# EasyEDA Pro project Temp_Con_V116.eprj, board TEMP_STM32
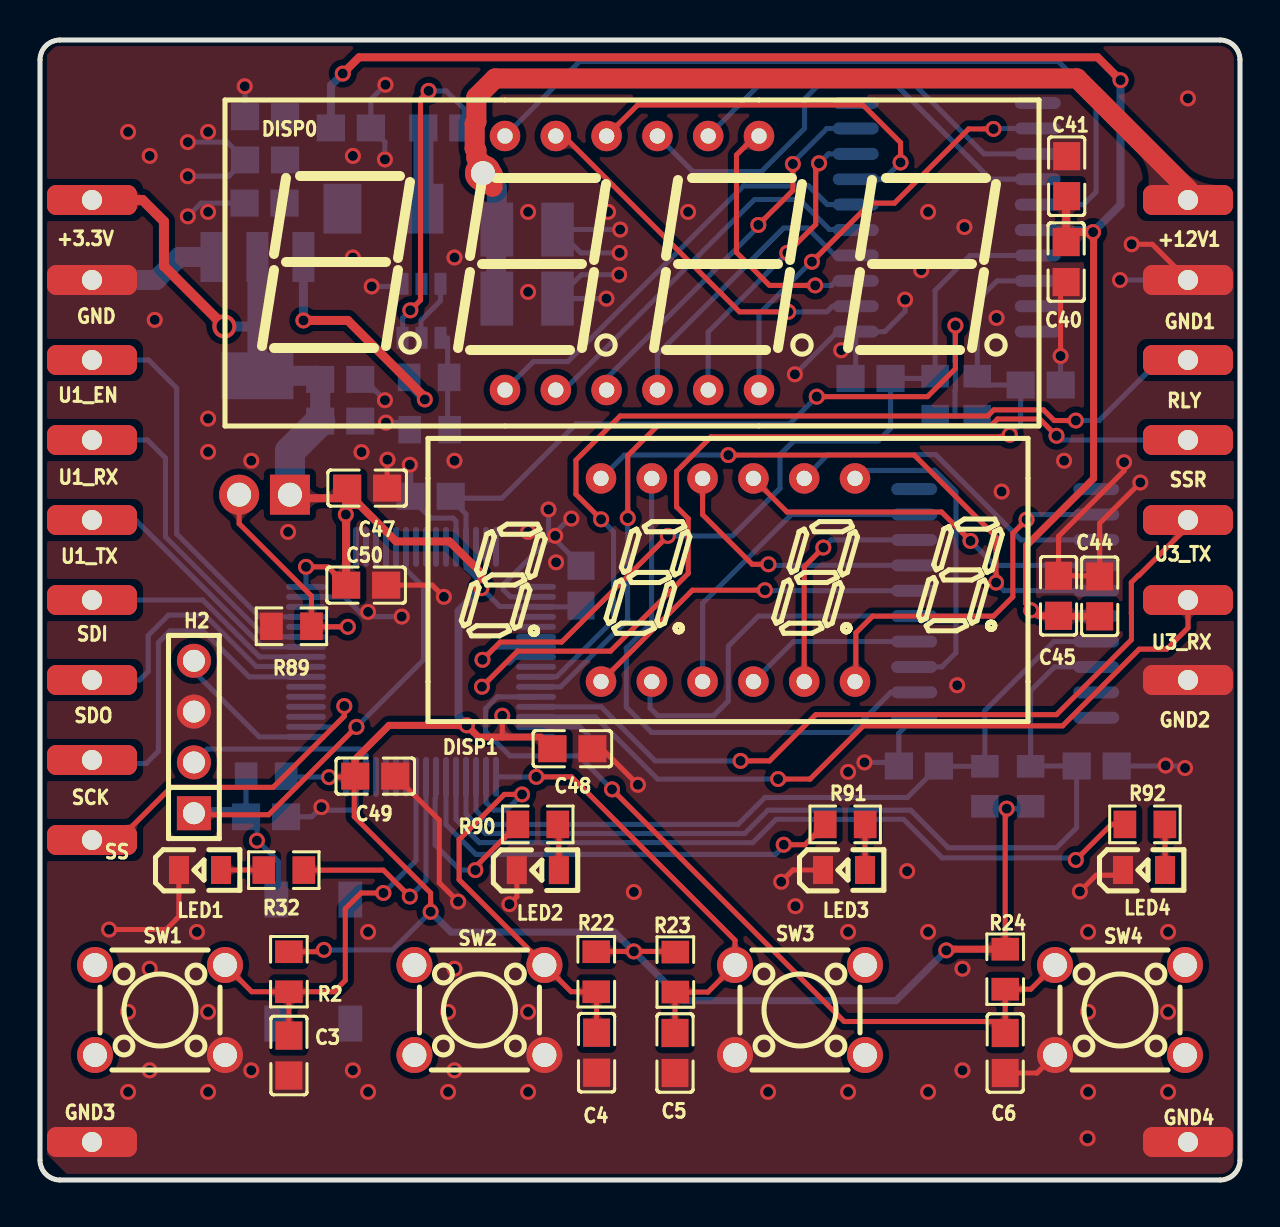
[diagram p6: board, top side]
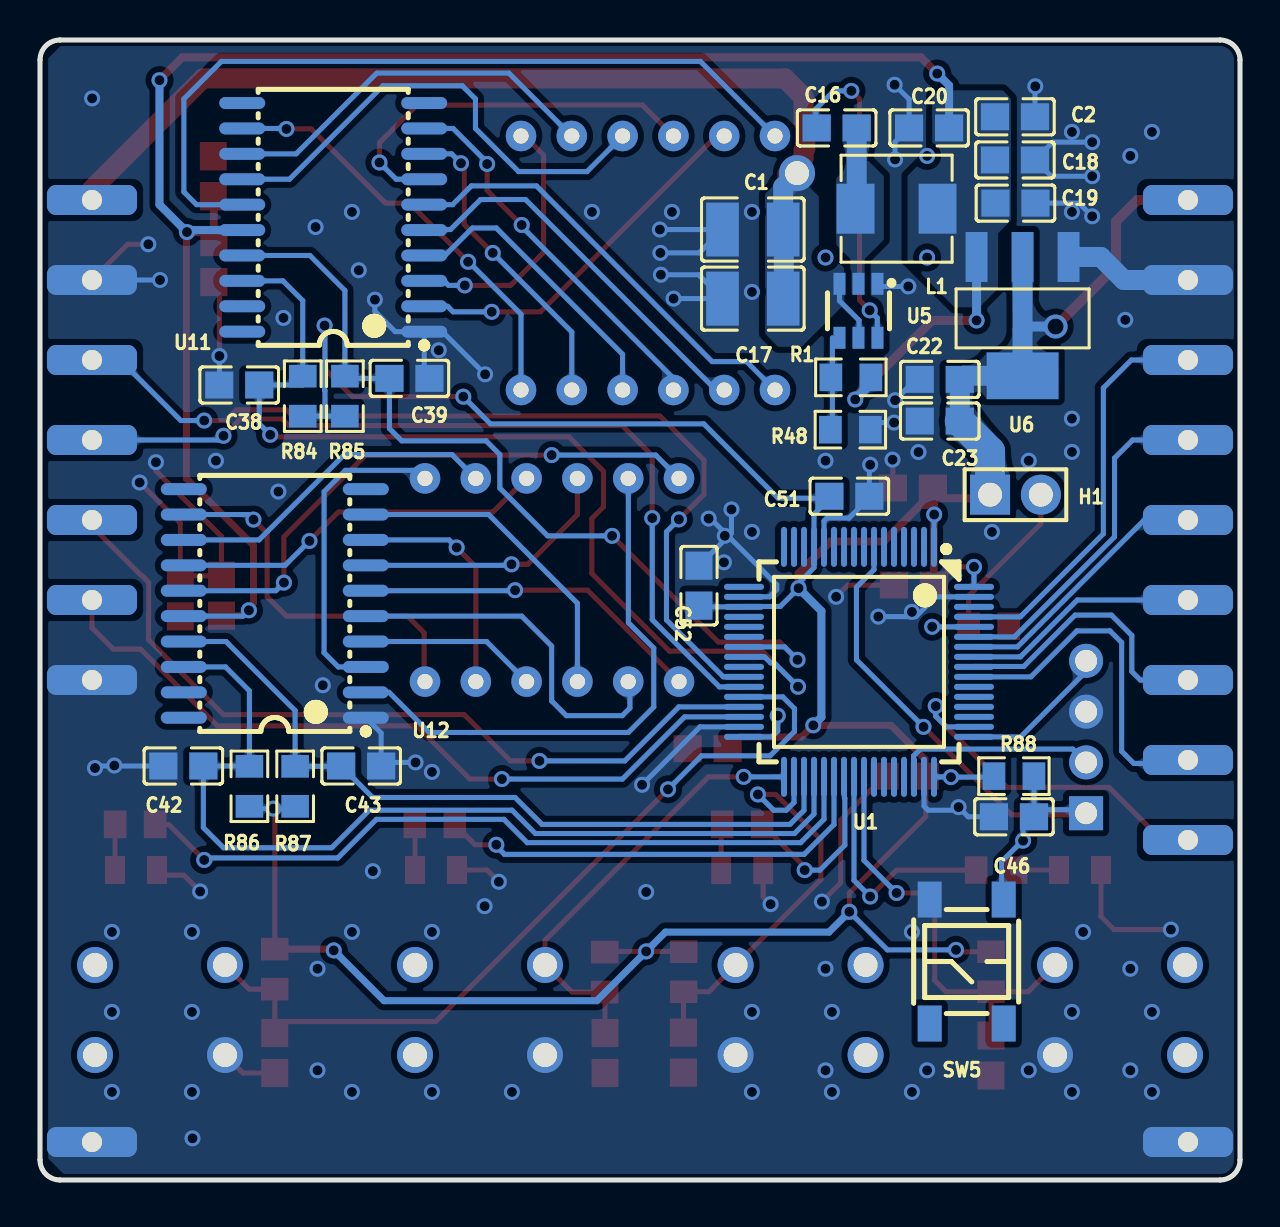
[diagram p7: board, bottom side, seen from below]

Outline 60 x 57 mm; copper layers: Top Layer, Bottom Layer. Coordinates in mm from the lower left corner of the outline.
Outline path: 0,56 0,1 arc(0.29,0.29) 1,0 59,0 arc(59.71,0.29) 60,1 60,56 arc(59.71,56.71) 59,57 1,57 arc(0.29,56.71) 0,56
Stack: Top Layer 0.035mm / Dielectric1 1.51mm FR4 er 4.5 / Bottom Layer 0.035mm

## Design rules (mm)
template: Custom Config
spacing copperThickness1oz (default): track to track 0.203, other pairs 0.201 to 0.305
spacing copperThickness2oz: track to track 0.203, other pairs 0.152 to 0.3
track width copperThickness1oz (default): min 0.127, default 0.254, max 2.54
track width copperThickness2oz: min 0.203, default 0.254, max 2.54
differential pair differentialPair (default): width min 0.127, default 0.254, max 2.54; gap min 0.152, default 0.152
via viaSize (default): diameter min 0.5, default 0.8, max 10; hole min 0.5, default 0.5, max 10

## Placement (name value [footprint] x y rotation side)
+3.3V  -  [S_FT]  2.6 49 90 top
+12V1  -  [S_FT]  57.4 49 90 top
C1  10uF  [C1210]  24.36 47.52 180 bottom
C2  22uF  [C0805]  11.25 53.16 0 bottom
C3  100nF  [C0805]  12.45 6.22 90 top
C4  100nF  [C0805]  27.83 6.37 90 top
C5  100nF  [C0805]  31.75 6.35 90 top
C6  100nF  [C0805]  48.26 6.35 90 top
C16  100nF  [C0805]  20.17 52.6 180 bottom
C17  10uF  [C1210]  24.36 44.07 180 bottom
C18  22uF  [C0805]  11.25 51 0 bottom
C19  22uF  [C0805]  11.23 48.84 0 bottom
C20  100nF  [C0805]  15.54 52.6 180 bottom
C22  100nF  [C0805]  15.01 40.03 180 bottom
C23  10uF  [C0805]  15.01 37.95 180 bottom
C38  100pF  [C0805]  50.04 39.75 180 bottom
C39  100pF  [C0805]  41.53 40.08 0 bottom
C40  22uF  [C0805]  51.31 45.9 90 top
C41  100nF  [C0805]  51.33 50.19 270 top
C42  100pF  [C0805]  52.83 20.7 180 bottom
C43  100pF  [C0805]  43.94 20.7 0 bottom
C44  22uF  [C0805]  52.98 29.18 270 top
C45  100nF  [C0805]  50.93 29.21 270 top
C46  100nF  [C0805]  11.3 18.16 180 bottom
C47  100pF  [C0805]  16.36 34.59 180 top
C48  100pF  [C0805]  26.62 21.56 180 top
C49  100pF  [C0805]  16.76 20.19 180 top
C50  100pF  [C0805]  16.31 29.74 180 top
C51  100pF  [C0805]  19.53 34.19 0 bottom
C52  100pF  [C0805]  27.05 29.72 270 bottom
DISP0  FJ4401BH  [LED-SEG-TH_12P-L40.4-W16.0-P2.54-S12.70-BL]  29.6 45.85 0 top
DISP1  FJ3461BH  [LED-SEG-TH_12P-L30.0-W13.7-P2.54-S10.16-BL]  34.4 30 0 top
GND  -  [S_FT]  2.6 45 270 top
GND1  -  [S_FT]  57.4 45 90 top
GND2  -  [S_FT]  57.4 25 90 top
GND3  -  [S_FT]  2.6 1.9 270 top
GND4  -  [S_FT]  57.4 1.9 90 top
H1  PZ254V-11-02P  [HDR-TH_2P-P2.54-V-M]  11.23 34.26 180 bottom
H2  PZ254V-11-04P  [HDR-TH_4P-P2.54-V-M]  7.7 22.15 90 top
L1  3.3uH  [IND-SMD_L5.4-W5.2_RS0530]  17.17 48.56 0 bottom
LED1  XL-2012SURC  [LED0805-R-RD]  8 15.5 0 top
LED2  XL-2012SURC  [LED0805-R-RD]  24.89 15.49 0 top
LED3  XL-2012SURC  [LED0805-R-RD]  40.2 15.5 0 top
LED4  XL-2012SURC  [LED0805-R-RD]  55.2 15.5 0 top
NOREF  -  [Pad_e2339]  22.15 50.34 0 top
R1  56.2kΩ  [R0805]  19.46 40.13 0 bottom
R2  10kΩ  [R0805]  12.45 10.41 90 top
R22  10kΩ  [R0805]  27.81 10.41 90 top
R23  10kΩ  [R0805]  31.77 10.4 90 top
R24  10kΩ  [R0805]  48.26 10.54 90 top
R32  1kΩ  [R0805]  12.19 15.49 0 top
R48  10kΩ  [R0805]  19.48 37.52 0 bottom
R84  10kΩ  [R0805]  46.86 39.19 270 bottom
R85  10kΩ  [R0805]  44.75 39.19 270 bottom
R86  10kΩ  [R0805]  49.53 19.69 270 bottom
R87  10kΩ  [R0805]  47.24 19.69 270 bottom
R88  10kΩ  [R0805]  11.3 20.19 0 bottom
R89  10kΩ  [R0805]  12.57 27.69 0 top
R90  1kΩ  [R0805]  24.89 17.78 180 top
R91  1kΩ  [R0805]  40.26 17.78 180 top
R92  1kΩ  [R0805]  55.25 17.78 180 top
RLY  -  [S_FT]  57.4 41 90 top
SCK  -  [S_FT]  2.6 21 270 top
SDI  -  [S_FT]  2.6 29 90 top
SDO  -  [S_FT]  2.6 25 90 top
SS  -  [S_FT]  2.6 17 90 top
SSR  -  [S_FT]  57.4 37 90 top
SW1  YTS1R0011FBT00  [SW-TH_4P-L6.0-W6.0-P4.50-LS6.5]  6 8.5 0 top
SW2  YTS1R0011FBT00  [SW-TH_4P-L6.0-W6.0-P4.50-LS6.5]  21.97 8.5 0 top
SW3  YTS1R0011FBT00  [SW-TH_4P-L6.0-W6.0-P4.50-LS6.5]  38 8.5 0 top
SW4  YTS1R0011FBT00  [SW-TH_4P-L6.0-W6.0-P4.50-LS6.5]  54 8.5 0 top
SW5  TSC005A1618A03  [KEY-SMD_4P-L5.2-W5.2-P3.70-LS6.4]  13.67 10.92 270 bottom
U1  STM32F103RCT6  [LQFP-64_L10.0-W10.0-P0.50-LS12.0-BL]  19.05 25.91 0 bottom
U1_EN  -  [S_FT]  2.6 41 90 top
U1_RX  -  [S_FT]  2.6 37 90 top
U1_TX  -  [S_FT]  2.6 33 90 top
U3_RX  -  [S_FT]  57.4 29 90 top
U3_TX  -  [S_FT]  57.4 33 90 top
U5  TPS562208DDCR  [SOT-23-6_L2.9-W1.6-P0.95-LS2.8-BR]  19.08 43.46 90 bottom
U6  AMS1117-3.3  [SOT-223-3_L6.5-W3.4-P2.30-LS7.0-BR]  10.87 43.18 90 bottom
U11  TM1637  [SOP-20_L12.8-W7.5-P1.27-LS10.4-BL]  45.34 48.13 90 bottom
U12  TM1637  [SOP-20_L12.8-W7.5-P1.27-LS10.4-BL]  48.26 28.83 90 bottom

## Footprints (pads in the part's own frame, mm; a bottom-side part is the same pattern mirrored in y, then rotated)
C0805
  rect 1.41x1.35 smd: 1(-1,0) 2(1,0)
C1210
  rect 1.635x2.7 smd: 1(-1.518,0) 2(1.518,0)
HDR-TH_2P-P2.54-V-M
  rect 2x2 hole 1.2: 1(-1.27,0)
  round 2 hole 1.2: 2(1.27,0)
HDR-TH_4P-P2.54-V-M
  rect 1.7x1.7 hole 1.1: 1(-3.81,0)
  round 1.7 hole 1.1: 2(-1.27,0) 3(1.27,0) 4(3.81,0)
IND-SMD_L5.4-W5.2_RS0530
  rect 1.9x2.5 smd: 1(2.05,0) 2(-2.05,0)
KEY-SMD_4P-L5.2-W5.2-P3.70-LS6.4
  rect 1.8x1.2 smd: 1(-3.1,1.85) 2(3.1,1.85) 3(-3.1,-1.85) 4(3.1,-1.85)
LED0805-R-RD
  rect 1x1.399 smd: 1(1.05,0) 2(-1.05,0)
LED-SEG-TH_12P-L30.0-W13.7-P2.54-S10.16-BL
  round 1.524 hole 0.762: 1(-6.35,-5.08) 2(-3.81,-5.08) 3(-1.27,-5.08) 4(1.27,-5.08) 5(3.81,-5.08) 6(6.35,-5.08) 7(6.35,5.08) 8(3.81,5.08) 9(1.27,5.08) 10(-1.27,5.08) 11(-3.81,5.08) 12(-6.35,5.08)
LED-SEG-TH_12P-L40.4-W16.0-P2.54-S12.70-BL
  round 1.524 hole 0.762: 1(-6.35,-6.35) 2(-3.81,-6.35) 3(-1.27,-6.35) 4(1.27,-6.35) 5(3.81,-6.35) 6(6.35,-6.35) 7(6.35,6.35) 8(3.81,6.35) 9(1.27,6.35) 10(-1.27,6.35) 11(-3.81,6.35) 12(-6.35,6.35)
LQFP-64_L10.0-W10.0-P0.50-LS12.0-BL
  oval 0.3x2 smd: 1(-3.75,-5.75) 2(-3.25,-5.75) 3(-2.75,-5.75) 4(-2.25,-5.75) 5(-1.75,-5.75) 6(-1.25,-5.75) 7(-0.75,-5.75) 8(-0.25,-5.75) 9(0.25,-5.75) 10(0.75,-5.75) 11(1.25,-5.75) 12(1.75,-5.75) 13(2.25,-5.75) 14(2.75,-5.75) 15(3.25,-5.75) 16(3.75,-5.75) 33(3.75,5.75) 34(3.25,5.75) 35(2.75,5.75) 36(2.25,5.75) 37(1.75,5.75) 38(1.25,5.75) 39(0.75,5.75) 40(0.25,5.75) 41(-0.25,5.75) 42(-0.75,5.75) 43(-1.25,5.75) 44(-1.75,5.75) 45(-2.25,5.75) 46(-2.75,5.75) 47(-3.25,5.75) 48(-3.75,5.75)
  oval 2x0.3 smd: 17(5.75,-3.75) 18(5.75,-3.25) 19(5.75,-2.75) 20(5.75,-2.25) 21(5.75,-1.75) 22(5.75,-1.25) 23(5.75,-0.75) 24(5.75,-0.25) 25(5.75,0.25) 26(5.75,0.75) 27(5.75,1.25) 28(5.75,1.75) 29(5.75,2.25) 30(5.75,2.75) 31(5.75,3.25) 32(5.75,3.75) 49(-5.75,3.75) 50(-5.75,3.25) 51(-5.75,2.75) 52(-5.75,2.25) 53(-5.75,1.75) 54(-5.75,1.25) 55(-5.75,0.75) 56(-5.75,0.25) 57(-5.75,-0.25) 58(-5.75,-0.75) 59(-5.75,-1.25) 60(-5.75,-1.75) 61(-5.75,-2.25) 62(-5.75,-2.75) 63(-5.75,-3.25) 64(-5.75,-3.75)
Pad_e2339
  round 1.8 hole 1.2: 1(0,0)
R0805
  rect 1.133x1.377 smd: 1(-1,0) 2(1,0)
S_FT
  rrect 1.5x4.5 hole 1: 1(0,0)
SOP-20_L12.8-W7.5-P1.27-LS10.4-BL
  oval 0.6x2.3 smd: 1(-5.715,-4.55) 2(-4.445,-4.55) 3(-3.175,-4.55) 4(-1.905,-4.55) 5(-0.635,-4.55) 6(0.635,-4.55) 7(1.905,-4.55) 8(3.175,-4.55) 9(4.445,-4.55) 10(5.715,-4.55) 11(5.715,4.55) 12(4.445,4.55) 13(3.175,4.55) 14(1.905,4.55) 15(0.635,4.55) 16(-0.635,4.55) 17(-1.905,4.55) 18(-3.175,4.55) 19(-4.445,4.55) 20(-5.715,4.55)
SOT-23-6_L2.9-W1.6-P0.95-LS2.8-BR
  rect 1.1x0.6 smd: 1(1.35,-0.95) 2(1.35,0) 3(1.35,0.95) 4(-1.35,0.95) 5(-1.35,0) 6(-1.35,-0.95)
SOT-223-3_L6.5-W3.4-P2.30-LS7.0-BR
  rect 2.5x1.1 smd: 1(2.97,-2.3) 2(2.97,0) 3(2.97,2.3)
  rect 2.34x3.6 smd: 4(-2.97,0)
SW-TH_4P-L6.0-W6.0-P4.50-LS6.5
  round 1.8 hole 1.2: 1(-3.25,2.25) 2(3.25,2.25) 3(-3.25,-2.25) 4(3.25,-2.25)

## Nets
As in the schematic, except:
+12V: +12V1.1 C1.2 C17.2 NOREF.1 U5.3 U5.5

Pads without a net: SW1 1 3; SW2 1 3; SW3 2 4; SW4 2 4; SW5 2 4; U1 2 3 4 5 6 8 9 10 11 14 15 16 17 20 21 22 25 42 43 44 45 51 52 53 54 62; U11 10 11 19 20; U12 10 11 19 20

## Via types
v1: diameter 0.8, hole 0.5, Top Layer to Bottom Layer, 161 vias
v2: diameter 1.2, hole 0.8, Top Layer to Bottom Layer, 1 via

## Routing (per net, layer and track width the routed paths; a pad name or vN(x,y) marks a point on that pad's centre or on a via; arc(x,y) is an arc through that point)
+3.3V: length 184.9
  Top Layer w0.254: R22.2 27.83,11.43 v1(29.69,11.43) 31.73,11.43 R23.2 ; v1(48.34,18.57) 48.26,18.49 R24.2 ; 15.71,20.14 C49.2 ; 15.71,20.14 v1(14.45,20.14) ; 15.71,20.14 15.71,18.17 19.53,14.35 v1(19.53,13.41) ; v1(38.84,39.17) 44.37,39.17 45.77,40.56 v1(45.77,42.72) ; v1(14.2,11.51) 14.11,11.41 R2.2 ; 25.03,22.15 C48.2 ; C50.2 14.39,30.66 v1(13.3,30.66) ; v1(23.11,23.22) 23.11,22.15
  Top Layer w0.35: 25.03,22.15 21.92,22.15 v1(21.34,22.73) 17.45,22.73 15.75,21.03 15.75,20.21 C49.2 ; R24.2 45.37,11.54 v1(45.31,11.48)
  Top Layer w0.4: C50.2 15.31,33.26 v1(15.29,33.27) 15.31,33.29 15.31,33.75 ; 15.31,33.75 15.31,34.09 12.67,34.09 H1.1 ; 15.31,33.75 15.82,33.75 15.85,33.78 15.95,33.78 17.81,31.93 20.47,31.93 22.07,30.33 v1(22.07,29.59)
  Top Layer w0.5: +3.3V.1 5.13,49 6.2,47.93 6.2,45.7 v2(9.22,42.67)
  Bottom Layer w0.254: U1.64 v1(13.3,30.66) ; U1.32 23.41,22.16 23.11,22.45 v1(23.11,23.22) ; U1.1 15.3,33.27 v1(15.29,33.27) ; v1(19.53,13.41) 17.63,11.51 v1(14.2,11.51) ; v1(45.77,42.72) 45.75,42.7 45.75,40.92 45.77,40.89 45.77,39.49 45.75,39.46 45.75,38.19 ; R87.2 47.36,18.57 v1(48.34,18.57) 49.41,18.57 R86.2 ; R88.2 12.35,20.14 v1(14.45,20.14) 14.47,20.16 U1.48 ; 45.75,38.19 R84.2 ; 45.75,38.19 R85.2 ; C52.2 26.99,28.66 U1.19 24.78,28.68 22.99,28.68 v1(22.07,29.59) 22.07,29.84 21.3,30.62 U1.13 21.3,33.29 20.53,34.06 20.55,34.09 23.09,34.09 26.81,37.81 37.48,37.81 v1(38.84,39.17)
  Bottom Layer w0.35: v1(45.31,11.48) 42.8,8.97 32.16,8.97 v1(29.69,11.43) 28.73,12.39 20.55,12.39 v1(19.53,13.41)
  Bottom Layer w0.4: v1(21.34,22.73) 20.93,23.14 20.93,28.45 v1(22.07,29.59)
  Bottom Layer w0.5: 10.87,42.51 10.7,42.67 v2(9.22,42.67)
  Bottom Layer w1: C23.2 C22.2 13.83,40.21 U6.4 U6.2
  Bottom Layer w1.5: H1.1 12.5,36.43 C23.2
+5V: length 96.9
  Top Layer w0.254: v1(49.56,28.49) 49.56,28.63
  Top Layer w0.35: C44.2 50.95,28.18 C45.2 49.97,28.21 49.56,28.63 49.33,28.85 49.33,31.72 52.68,35.08 52.68,47.09
  Top Layer w0.4: v1(52.65,47.4) 51.81,47.4 C40.2 51.31,49.13 arc(51.31,49.16) C41.2 ; v1(15.14,55.32) 15.95,56.13 52.88,56.13 v1(54.03,54.99)
  Top Layer w0.45: v1(19.24,39.03) 19.24,39.13 15.39,42.98 v1(13.17,42.98)
  Bottom Layer w0.254: U12.16 49.85,28.19 v1(49.56,28.49)
  Bottom Layer w0.4: v1(54.03,54.99) 54.03,48.77 v1(52.65,47.4) 52.55,47.5 U11.16 ; C20.2 14.54,54.73 v1(15.14,55.32)
  Bottom Layer w0.45: v1(19.24,39.03) 18.46,39.81 R1.1 ; U6.3 v1(13.17,42.98)
+12V: length 53.7
  Top Layer w1: +12V1.1 57.4,49.53 51.85,55.08 22.75,55.08 21.82,54.14 21.82,52.91 21.73,52.83 21.73,51.57 21.82,51.49 21.82,51.11 22.63,50.29 22.63,49.66
  Bottom Layer w0.254: 19.05,41.76 19.05,42.99 20.03,43.96 U5.3
  Bottom Layer w1: NOREF.1 22.84,49.65 C1.2 ; 22.81,47.52 22.81,44.1 C17.2
GND: length 147.8
  Top Layer w0.254: C47.1 17.36,36 v1(17.37,36.02) ; C6.1 49.85,5.35 SW4.3 ; GND1.1 55.61,46.79 v1(54.58,46.79) ; v1(23.47,13.79) 23.84,14.16 LED2.2 ; v1(20.9,13.92) 19.96,14.86 19.96,17.99 C49.1 ; v1(20.19,29.16) 19.61,29.74 C50.1 ; LED4.2 53.89,15.24 52.81,15.24 v1(51.99,14.43) ; v1(29.9,19.76) 28.09,21.56 C48.1 ; LED1.2 6.95,13.17 6.3,12.52 v1(3.45,12.52) ; v1(54.2,35.89) 54.2,35.46 50.93,32.18 C45.1 52.96,30.21 C44.1 52.98,32.84 v1(55.02,34.87) ; 51.05,45.36 51.03,45.33 v1(51.03,41.2) ; LED3.2 37.65,15.5 v1(37.06,14.91)
  Bottom Layer w0.254: v1(10.24,54.69) 10.25,54.67 C2.1 ; C39.1 40.79,40.34 U11.1 ; v1(25.43,33.53) 25.43,32.34 25.58,32.19 ; v1(29.9,19.76) 27,22.66 U1.31 ; C52.1 25.58,32.19 ; 25.58,32.19 26.47,33.07 v1(26.57,33.07) ; 25.58,32.19 23.16,29.77 23.16,29.52 23.52,29.16 24.8,29.16 ; U1.63 15.22,29.16 16.21,28.17 v1(18.09,28.17) ; v1(16.59,44.68) 17.99,44.68 U5.1 ; C51.1 18.53,35.72 v1(18.49,35.76) ; v1(17.27,54.76) 16.54,54.03 C20.1 17.25,51.9 v1(17.25,51.03) ; U1.47 15.8,18.7 15.6,18.49 14.22,18.49 v1(14.07,18.64) 13.59,18.16 C46.1 ; 18.58,34.06 19.55,33.1 20.65,33.1 20.8,32.95 U1.12 ; v1(51.03,41.2) 51.03,39.76 C38.1 ; v1(17.3,37.87) 18.13,37.87 R48.1 ; C22.1 16.21,40.03 v1(17.25,38.99) ; v1(41.22,20.88) 42.76,20.88 C43.1 42.94,22.35 U12.1 ; v1(28.96,45.26) 27.07,45.26 C17.1 v1(28.32,44.07) ; v1(7.39,50.19) 9.44,50.19 C18.1 9.36,51.89 v1(7.39,51.89) ; 18.53,34.06 18.53,34.06 ; U11.1 39.88,42.42 v1(37.74,40.28) ; U11.1 42.24,42.42 43.26,43.43 v1(43.26,44.02) ; C19.1 8.05,48.84 v1(7.39,48.18) ; GND1.1 v1(54,45) ; v1(29.01,47.52) C1.1 27.04,46.36 v1(28.98,46.36) ; v1(57.25,20.6) 57.15,20.7 C42.1
  Bottom Layer w1: U6.1 6.96,46.15 5.81,45 GND.1
  vias: v1(4.4,52.4) v1(4.4,8.4) v1(4.4,4.4) v1(5.48,51.2) v1(5.48,10.56) v1(5.48,5.48) v1(5.74,43.01) v1(7.85,12.4) v1(8.4,52.4) v1(8.4,48.4) v1(8.4,38.07) v1(8.4,36.4) v1(8.4,8.4) v1(8.4,4.4) v1(10.56,35.96) v1(10.56,5.48) v1(12.4,32.4) v1(15.64,51.2) v1(15.64,46.12) v1(15.64,5.48) v1(16.08,36.4) v1(16.4,28.4) v1(16.4,12.4) v1(16.4,4.4) v1(20.4,8.4) v1(20.4,4.4) v1(20.72,46.12) v1(20.72,35.96) v1(20.72,10.56) v1(20.72,5.48) v1(24.4,48.4) v1(24.4,44.4) v1(24.4,32.4) v1(24.4,8.4) v1(24.4,4.4) v1(25.76,32.21) v1(25.8,30.88) v1(28.4,48.4) v1(29.69,14.4) v1(32.4,48.4) v1(36.4,4.4) v1(37.77,13.69) v1(40.06,41.49) v1(40.4,20.4) v1(40.4,12.4) v1(40.4,4.4) v1(43.36,15.44) v1(44.06,45.49) v1(44.4,48.4) v1(44.4,12.4) v1(44.4,4.4) v1(45.86,24.74) v1(46.12,10.56) v1(46.12,5.48) v1(46.22,47.65) v1(47.83,43.1) v1(48.08,34.42) v1(51.2,35.96) v1(52.4,12.4) v1(52.4,8.4) v1(52.4,4.4) v1(52.38,2.08) v1(56.28,20.72) v1(56.4,12.4) v1(56.4,8.4) v1(56.4,4.4) v1(57.39,54.08)
BOOT0: length 12
  Top Layer w0.254: v1(15.39,27.66) 13.6,27.66 R89.2 13.57,29.2 9.96,32.82 H1.2
  Bottom Layer w0.254: v1(15.39,27.66) 15.39,27.66 U1.60
CLK1: length 50.9
  Top Layer w0.254: v1(22.1,24.66) 23.88,26.44 28.52,26.44 32.41,30.33 32.41,33.07 31.83,33.66 31.83,35.43 33.55,37.16 48.39,37.16 v1(48.49,37.26)
  Bottom Layer w0.254: v1(48.49,37.26) 49.04,37.81 C38.2 46.88,39.75 46.86,39.73 ; v1(22.1,24.66) 23.29,25.86 23.47,25.86 23.75,26.14 23.78,26.14 23.8,26.16 U1.24 ; U11.18 47.85,44.96 46.86,43.97 R84.1
CLK2: length 47.4
  Bottom Layer w0.254: U12.18 50.72,25.65 49.53,24.46 R86.1 49.55,20.7 C42.2 51.83,17.62 50.83,16.61 45.41,16.61 43.54,18.49 36.4,18.49 35.23,17.32 22.28,17.32 21.3,18.3 U1.36
DIG_1: length 39.7
  Bottom Layer w0.254: DISP0.12 26.98,55.93 50.93,55.93 52.81,54.05 52.81,49.4 52.17,48.77 U11.15
DIG_2: length 24.3
  Bottom Layer w0.254: DISP0.9 32.65,50.42 36.07,50.42 38.23,52.58 38.23,54.05 38.89,54.71 42.85,54.71 47.52,50.04 U11.14
DIG_3: length 19.5
  Bottom Layer w0.254: DISP0.8 36.56,55.35 43.15,55.35 47.19,51.31 U11.13
DIG_4: length 21.6
  Top Layer w0.254: v1(47.68,52.55) 46.43,52.55 42.72,48.84 41.53,48.84 v1(38.6,45.91)
  Bottom Layer w0.254: U11.12 47.7,52.58 v1(47.68,52.55) ; v1(38.6,45.91) 38.57,45.91 35.95,43.29 DISP0.6
DIG_5: length 29.4
  Top Layer w0.254: v1(47.8,29.87) 47.8,32.16 43.71,36.25 v1(34.42,36.25)
  Bottom Layer w0.254: v1(47.8,29.87) 48.21,29.46 U12.15 ; v1(34.42,36.25) 29.22,36.25 DISP1.12
DIG_6: length 18.9
  Top Layer w0.254: v1(46.53,31.95) 45.08,33.4 37.35,33.4 DISP1.9
  Bottom Layer w0.254: v1(46.53,31.95) 47.75,30.73 U12.14
DIG_7: length 16.9
  Bottom Layer w0.254: DISP1.8 39.4,36.27 44.78,36.27 49.05,32 U12.13
DIG_8: length 18.8
  Top Layer w0.254: v1(49.33,33.02) 48.64,32.33 48.64,29.16 47.68,28.19 41.63,28.19 40.79,27.36 40.79,24.96 DISP1.6
  Bottom Layer w0.254: U12.12 49.58,33.27 v1(49.33,33.02)
DIO1: length 44
  Top Layer w0.254: v1(31.39,32.21) 26.09,26.9 23.01,26.9 v1(22.12,26.01)
  Bottom Layer w0.254: U11.17 46.51,46.23 44.75,44.48 R85.1 44.64,40.08 C39.2 42.53,37.57 41.91,36.96 37.69,36.96 37.01,36.27 37.01,34.59 34.62,32.21 v1(31.39,32.21) ; v1(22.12,26.01) 22.77,26.66 U1.23
DIO2: length 38.4
  Bottom Layer w0.254: U12.17 50.7,26.92 47.24,23.47 R87.1 44.96,20.69 C43.2 43.37,19.13 36.25,19.13 34.9,17.78 22.5,17.78 21.8,18.48 U1.35
LD1: length 12.2
  Top Layer w0.254: v1(18.49,14.17) 17.17,15.49 R32.2
  Bottom Layer w0.254: v1(18.49,14.17) 19.3,14.98 U1.40
LD2: length 9.1
  Top Layer w0.254: R90.2 21.77,15.66 v1(21.77,15.49)
  Bottom Layer w0.254: v1(21.77,15.49) 21.01,15.49 19.76,16.74 19.76,19.09 19.78,19.11 19.78,20.14 U1.39
LD3: length 22.6
  Top Layer w0.254: R91.2 38.24,16.76 v1(37.19,16.76)
  Bottom Layer w0.254: v1(37.19,16.76) 37.19,16.69 36.78,16.28 21.79,16.28 20.3,17.77 U1.38
LD4: length 38.1
  Top Layer w0.254: R92.2 53.57,17.78 v1(51.79,16)
  Bottom Layer w0.254: U1.37 20.8,18.04 21.97,16.87 35.64,16.87 36.8,18.03 43.18,18.03 45.11,16.1 51.69,16.1 v1(51.79,16)
M_SCK: length 17.7
  Bottom Layer w0.254: SCK.1 2.77,20.83 5.31,20.83 5.92,21.44 5.92,26.87 6.5,27.46 8.15,27.46 10.45,25.16 U1.55
M_SDI: length 11.9
  Bottom Layer w0.254: SDI.1 8.14,29 10.98,26.16 U1.57
M_SDO: length 14.2
  Bottom Layer w0.254: SDO.1 4.98,25 5.41,25.43 5.41,27.23 6.43,28.25 8.25,28.25 10.81,25.68 13.28,25.68 U1.56
M_SS: length 18.3
  Top Layer w0.254: SS.1 3.92,17 6.55,19.63 11.66,19.63 15.21,23.19 v1(15.21,23.7)
  Bottom Layer w0.254: U1.50 14.68,22.66 15.21,23.19 v1(15.21,23.7)
RLY: length 46.9
  Top Layer w0.254: v1(28.05,33.03) 26.8,34.29 26.8,35.99 29.01,38.2 47.38,38.2 47.69,38.51 50.18,38.51 50.71,37.97 v1(51.79,37.97)
  Bottom Layer w0.254: RLY.1 55.99,41 52.96,37.97 v1(51.79,37.97) ; U1.26 25.83,25.16 28.68,28.01 28.68,32.41 v1(28.05,33.03)
RST: length 30.9
  Top Layer w0.254: 7.7,19 8.43,18.26 11.43,18.26 v1(15.82,22.66)
  Bottom Layer w0.254: C46.2 9.95,18.52 8.18,18.52 7.7,19 ; C46.2 10.85,17.62 v1(10.85,16.97) 10.87,16.97 11.92,15.92 11.92,14.12 SW5.1 ; C46.2 R88.1 ; v1(15.82,22.66) 19.18,26.01 19.18,29.64 18.3,30.52 U1.7
SEG_A1: length 18.8
  Top Layer w0.254: DISP0.11 26.18,52.2 34.98,43.41 v1(37.41,43.41)
  Bottom Layer w0.254: v1(37.41,43.41) 39.34,43.41 39.62,43.69 U11.2
SEG_A2: length 27.7
  Bottom Layer w0.254: DISP1.11 30.58,35.07 30.58,27.86 29.31,26.59 29.31,23.65 30.58,22.38 40.54,22.38 42.54,24.38 U12.2
SEG_B1: length 13.1
  Top Layer w0.254: DISP0.7 35.77,52.2 34.82,51.25 34.82,46.38 36.47,44.73 v1(38.76,44.73)
  Bottom Layer w0.254: U11.3 39.8,44.96 39.57,44.73 v1(38.76,44.73)
SEG_B2: length 16.1
  Bottom Layer w0.254: DISP1.7 41.15,35.48 44.73,35.48 45.8,34.42 45.8,26.36 45.09,25.65 U12.3
SEG_C1: length 14.9
  Bottom Layer w0.254: DISP0.4 30.87,41.28 37.19,47.6 38.38,47.6 39.75,46.23 U11.4
SEG_C2: length 8.9
  Bottom Layer w0.254: U12.4 37.67,26.92 DISP1.4
SEG_D1: length 19.6
  Bottom Layer w0.254: U11.5 40.76,47.52 39.47,47.52 37.97,49.02 35.72,49.02 26.23,39.53 25.82,39.53 DISP0.2
SEG_D2: length 18.4
  Bottom Layer w0.254: DISP1.2 30.51,24.84 30.51,23.6 30.89,23.22 33.68,23.22 34.42,23.95 34.42,26.7 35.92,28.19 U12.5
SEG_E1: length 22.2
  Bottom Layer w0.254: DISP0.1 24.67,40.92 26.39,40.92 35.18,49.71 38.43,49.71 39.37,48.77 U11.6
SEG_E2: length 17.6
  Top Layer w0.254: DISP1.1 32.62,29.49 v1(36.25,29.49)
  Bottom Layer w0.254: U12.6 36.27,29.46 v1(36.25,29.49)
SEG_F1: length 19.7
  Top Layer w0.254: DISP0.10 29.88,53.75 41.15,53.75 43.03,51.87 v1(43.03,50.88)
  Bottom Layer w0.254: U11.7 42.19,50.04 v1(43.03,50.88)
SEG_F2: length 13.4
  Top Layer w0.254: DISP1.10 33.13,33.27 35.61,30.78 v1(36.42,30.78)
  Bottom Layer w0.254: U12.7 36.47,30.73 v1(36.42,30.78)
SEG_G1: length 15.7
  Top Layer w0.254: v1(37.36,46.36) 38.79,47.78 38.79,50.67 v1(38.95,50.84)
  Bottom Layer w0.254: v1(38.95,50.84) 39.42,51.31 U11.8 ; DISP0.5 33.41,42.4 v1(37.36,46.36)
SEG_G2: length 11.8
  Top Layer w0.254: DISP1.5 38.21,30.67 v1(39.17,31.62)
  Bottom Layer w0.254: U12.8 39.55,32 v1(39.17,31.62)
SEG_H1: length 19.1
  Top Layer w0.254: v1(35.92,47.75) 37.64,49.48 v1(37.64,50.8)
  Bottom Layer w0.254: DISP0.3 28.33,40.09 35.92,47.68 v1(35.92,47.75) ; v1(37.64,50.8) 37.64,50.88 39.34,52.58 U11.9
SEG_H2: length 16.3
  Bottom Layer w0.254: U12.9 37.57,33.27 33.13,28.84 DISP1.3
SSR: length 43.4
  Top Layer w0.254: v1(29.39,33.1) 29.39,36.22 30.89,37.72 47.55,37.72 47.88,38.05 49.99,38.05 v1(50.83,37.21)
  Bottom Layer w0.254: v1(50.83,37.21) 51.04,37 SSR.1 ; v1(29.39,33.1) 29.39,28.02 26.03,24.66 U1.27
SW1: length 21.3
  Top Layer w0.254: v1(17.17,14.35) 16.05,14.35 15.27,13.56 15.27,9.98 14.7,9.41 R2.1 ; C3.2 R2.1 ; R2.1 10.59,9.41 SW1.2
  Bottom Layer w0.254: U1.41 18.8,15.98 v1(17.17,14.35)
SW2: length 20.9
  Top Layer w0.254: C4.2 27.83,9.4 R22.1 26.56,9.41 SW2.2 20.96,15.02 20.96,17.02 23.22,19.28 v1(24.1,19.28)
  Bottom Layer w0.254: U1.34 22.3,18.87 22.68,18.49 23.32,18.49 v1(24.1,19.28)
SW3: length 22.2
  Top Layer w0.254: C5.2 31.75,9.38 R23.1 33.4,9.4 SW3.1 34.75,11.99 26.58,20.16 v1(24.82,20.16)
  Bottom Layer w0.254: U1.33 v1(24.82,20.16)
SW4: length 41.3
  Top Layer w0.254: v1(28.6,19.53) 40.21,7.92 47.69,7.92 C6.2 R24.1 49.54,9.54 SW4.1
  Bottom Layer w0.254: U1.28 22.86,24.16 22.28,23.57 22.28,22.43 23.5,21.21 26.92,21.21 v1(28.6,19.53)
SWCLK: length 7.5
  Bottom Layer w0.254: H2.4 7.7,25.43 10.96,22.16 U1.49
SWDIO: length 10.1
  Bottom Layer w0.254: H2.2 8.36,21.55 15.98,21.55 16.32,21.21 16.32,20.18 U1.46
U1_EN: length 20.3
  Bottom Layer w0.254: U1_EN.1 5.43,41 6.83,39.6 6.83,32.31 10.98,28.16 U1.61
U1_RX: length 17.1
  Bottom Layer w0.254: U1_RX.1 5.37,37 6.27,36.09 6.27,32.16 11.27,27.16 U1.59
U1_TX: length 13.3
  Bottom Layer w0.254: U1.58 11.13,26.66 4.78,33 U1_TX.1
U3_RX: length 38.4
  Top Layer w0.254: U3_RX.1 57.4,27.61 56.34,26.54 54.97,26.54 51.13,22.71 41.17,22.71 38.51,20.05 v1(36.91,20.05)
  Bottom Layer w0.254: v1(36.91,20.05) 30.88,20.05 27.77,23.16 U1.30
U3_TX: length 40.6
  Top Layer w0.254: v1(35.03,20.95) 36.48,20.95 38.79,23.27 50.83,23.27 54.57,27.01 54.57,28.32 54.57,28.33 54.57,29.88 54.92,30.23 54.95,30.23 57.2,32.48 57.2,32.75 57.4,32.95 U3_TX.1
  Bottom Layer w0.254: v1(35.03,20.95) 30.76,20.95 28.06,23.66 U1.29
$1N5723: length 4.2
  Bottom Layer w1: C16.2 19.17,48.9 19.5,48.56
$1N5726: length 16.3
  Top Layer w0.254: v1(19.43,54.46) 19.02,54.05 19.02,43.99 v1(18.52,43.48)
  Bottom Layer w0.254: 18.14,41.8 18.14,43.1 v1(18.52,43.48) ; v1(19.43,54.46) 20.3,54.46 21.21,53.55 21.21,52.64 C16.1
$1N5728: length 4.2
  Bottom Layer w0.254: 20.38,42.11 20.38,38.02 20.48,37.92
$1N10529: length 2.1
  Top Layer w0.254: LED1.1 11.19,15.5 R32.1
$1N10623: length 2.3
  Top Layer w0.254: R90.1 25.94,17.73 LED2.1
$1N10717: length 2.3
  Top Layer w0.254: LED3.1 41.25,17.77 R91.1
$1N10811: length 2.3
  Top Layer w0.254: LED4.1 56.25,17.77 R92.1

## Copper pours and planes (outline as drawn; the poured copper is in the pictures)
+5V on Bottom Layer: 11.46,47.98 11.46,54.08 11.86,54.48 15.14,54.48 15.39,54.23 15.39,51.44 16.63,50.2 16.63,45.99 14.27,43.64 13.03,43.64 12.1,44.57 12.1,47.34
+12V on Bottom Layer: 19.79,45.6 21.06,46.86 21.06,49.18 21.66,49.78 23.27,49.78 23.75,49.3 23.75,42.31 23.1,41.66 21.92,41.66 19.79,43.78
GND on Top Layer: 0.36,56.28 1.36,57.28 59.36,57.28 60.36,56.28 60.36,1.28 59.36,0.28 1.36,0.28 0.36,1.27 0.36,1.27
GND on Bottom Layer: -0.41,56.08 0.59,57.08 58.59,57.08 59.59,56.08 59.59,1.08 58.59,0.08 0.59,0.08 -0.41,1.08
$1N5723 on Bottom Layer: 19.39,44.26 19.48,44.35 19.48,46.05 20.19,46.76 20.19,50.08 19.32,50.95 18.57,50.95 17.81,50.2 17.81,47.01 18.77,46.05 18.77,44.26

Small or netless copper shapes (teardrops, artwork), in the pictures only: 159 on Top Layer, 245 on Bottom Layer
